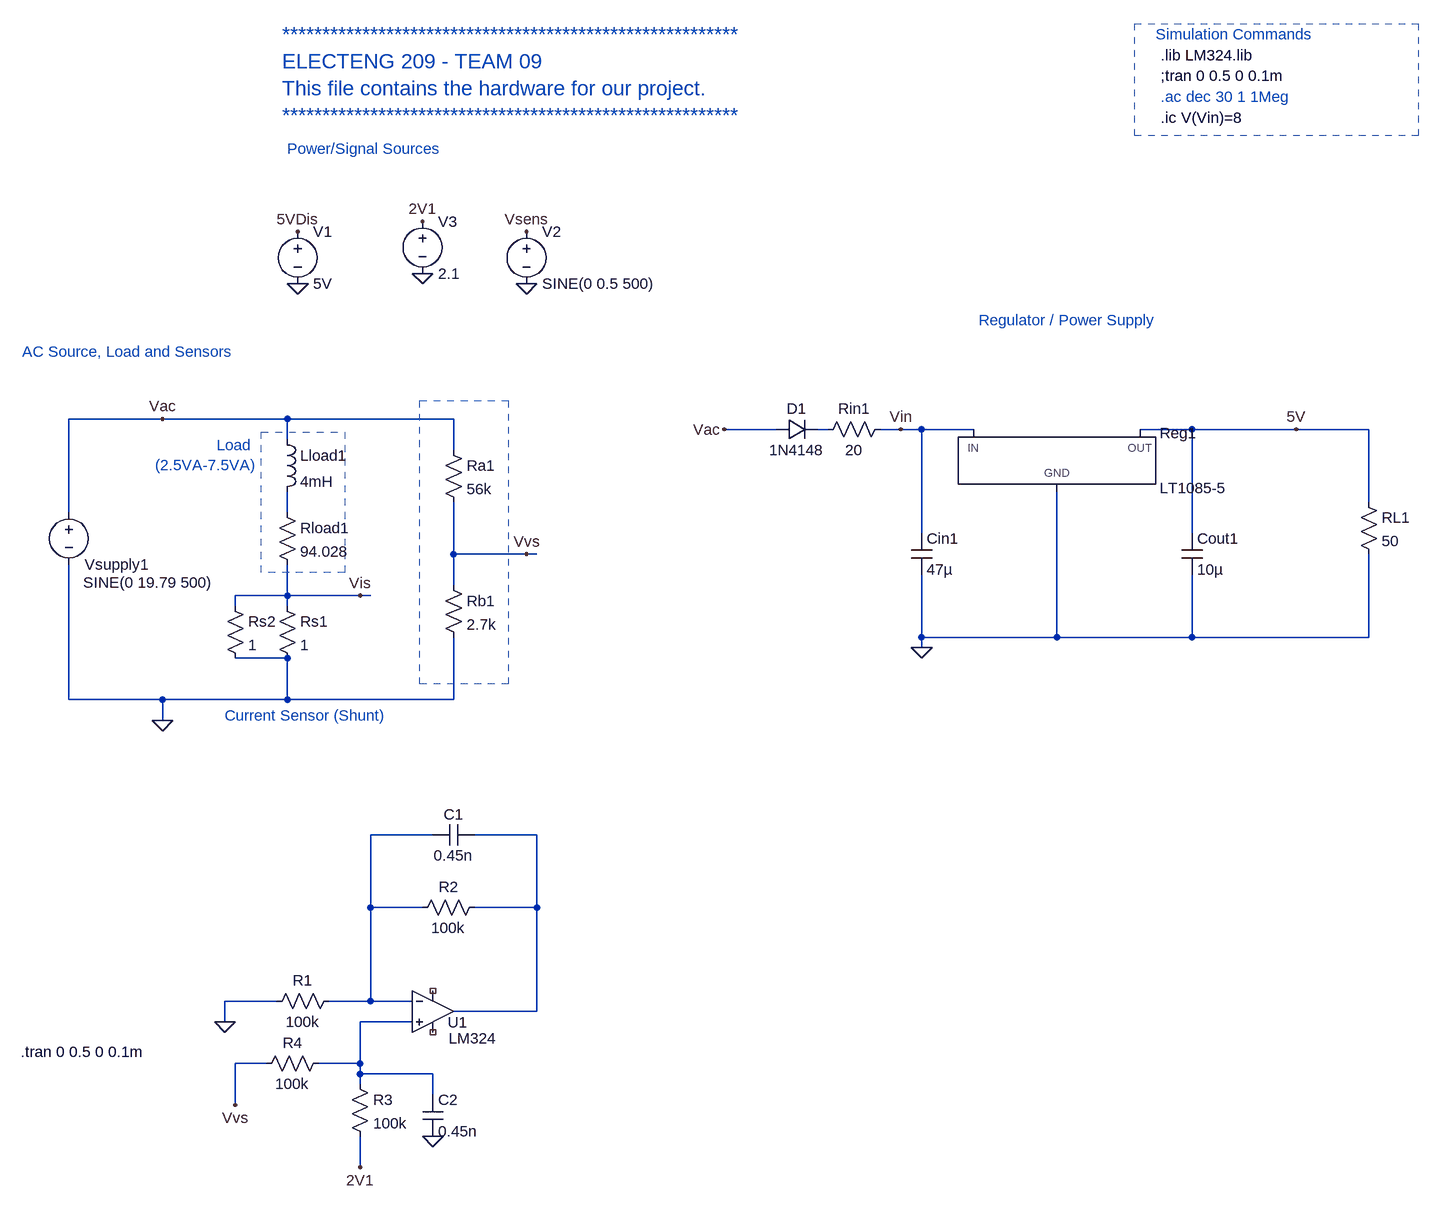
[diagram p0: schematic Final_Team_09_Hardware.asc]
Final_Team_09_Hardware.asc, the LTspice schematic file:
Version 4
SHEET 1 912 1884
WIRE -1024 640 -1168 640
WIRE -832 640 -1024 640
WIRE -576 640 -832 640
WIRE -80 656 -160 656
WIRE 0 656 -16 656
WIRE 112 656 80 656
WIRE 144 656 112 656
WIRE 224 656 144 656
WIRE 560 656 480 656
WIRE 720 656 560 656
WIRE 832 656 720 656
WIRE -832 672 -832 640
WIRE -576 688 -576 640
WIRE 832 768 832 656
WIRE -1168 784 -1168 640
WIRE -832 784 -832 752
WIRE 144 816 144 656
WIRE 560 816 560 656
WIRE -576 848 -576 768
WIRE -464 848 -576 848
WIRE -448 848 -464 848
WIRE -576 896 -576 848
WIRE -832 912 -832 864
WIRE -832 912 -912 912
WIRE -720 912 -832 912
WIRE -704 912 -720 912
WIRE -912 928 -912 912
WIRE -832 928 -832 912
WIRE 144 976 144 880
WIRE 352 976 352 752
WIRE 352 976 144 976
WIRE 560 976 560 880
WIRE 560 976 352 976
WIRE 832 976 832 848
WIRE 832 976 560 976
WIRE 144 992 144 976
WIRE -832 1008 -912 1008
WIRE -1168 1072 -1168 864
WIRE -1024 1072 -1168 1072
WIRE -832 1072 -832 1008
WIRE -832 1072 -1024 1072
WIRE -576 1072 -576 976
WIRE -576 1072 -832 1072
WIRE -1024 1104 -1024 1072
WIRE -608 1280 -704 1280
WIRE -448 1280 -544 1280
WIRE -704 1392 -704 1280
WIRE -624 1392 -704 1392
WIRE -448 1392 -448 1280
WIRE -448 1392 -544 1392
WIRE -848 1536 -928 1536
WIRE -704 1536 -704 1392
WIRE -704 1536 -768 1536
WIRE -640 1536 -704 1536
WIRE -448 1552 -448 1392
WIRE -448 1552 -576 1552
WIRE -928 1568 -928 1536
WIRE -640 1568 -720 1568
WIRE -864 1632 -912 1632
WIRE -720 1632 -720 1568
WIRE -720 1632 -784 1632
WIRE -720 1648 -720 1632
WIRE -608 1648 -720 1648
WIRE -720 1664 -720 1648
WIRE -608 1680 -608 1648
WIRE -912 1696 -912 1632
WIRE -720 1792 -720 1744
FLAG -816 432 0
FLAG -816 352 5VDis
FLAG -464 432 0
FLAG -464 352 Vsens
FLAG -1024 640 Vac
FLAG -720 912 Vis
FLAG -464 848 Vvs
FLAG -1024 1104 0
FLAG -160 656 Vac
FLAG 720 656 5V
FLAG 112 656 Vin
FLAG 144 992 0
FLAG -928 1568 0
FLAG -608 1744 0
FLAG -912 1696 Vvs
FLAG -720 1792 2V1
FLAG -624 416 0
FLAG -624 336 2V1
SYMBOL voltage -816 336 R0
WINDOW 123 0 0 Left 0
WINDOW 39 0 0 Left 0
SYMATTR InstName V1
SYMATTR Value 5V
SYMBOL voltage -464 336 R0
WINDOW 39 0 0 Left 0
SYMATTR InstName V2
SYMATTR Value SINE(0 0.5 500)
SYMATTR Value2 AC .1 0
SYMBOL voltage -1168 768 R0
WINDOW 0 24 96 Left 2
WINDOW 3 22 124 Left 2
WINDOW 123 0 0 Left 0
WINDOW 39 0 0 Left 0
SYMATTR InstName Vsupply1
SYMATTR Value SINE(0 19.79 500)
SYMBOL ind -848 656 R0
SYMATTR InstName Lload1
SYMATTR Value 4mH
SYMBOL res -592 672 R0
SYMATTR InstName Ra1
SYMATTR Value 56k
SYMBOL res -592 880 R0
SYMATTR InstName Rb1
SYMATTR Value 2.7k
SYMBOL res -848 768 R0
SYMATTR InstName Rload1
SYMATTR Value 94.028
SYMBOL PowerProducts/LT1085-5 352 656 R0
SYMATTR InstName Reg1
SYMBOL res 816 752 R0
SYMATTR InstName RL1
SYMATTR Value 50
SYMBOL res 96 640 R90
WINDOW 0 0 56 VBottom 2
WINDOW 3 32 56 VTop 2
SYMATTR InstName Rin1
SYMATTR Value 20
SYMBOL diode -80 672 R270
WINDOW 0 32 32 VTop 2
WINDOW 3 0 32 VBottom 2
SYMATTR InstName D1
SYMATTR Value 1N4148
SYMBOL cap 128 816 R0
SYMATTR InstName Cin1
SYMATTR Value 47µ
SYMATTR SpiceLine Rser=0.001
SYMBOL cap 544 816 R0
SYMATTR InstName Cout1
SYMATTR Value 10µ
SYMATTR SpiceLine Rser=0.001
SYMBOL res -848 912 R0
SYMATTR InstName Rs1
SYMATTR Value 1
SYMBOL res -928 912 R0
SYMATTR InstName Rs2
SYMATTR Value 1
SYMBOL Opamps/opamp2 -608 1488 R0
WINDOW 0 23 81 Left 2
WINDOW 3 24 105 Left 2
SYMATTR InstName U1
SYMATTR Value LM324
SYMBOL res -752 1520 R90
WINDOW 0 0 56 VBottom 2
WINDOW 3 32 56 VTop 2
SYMATTR InstName R1
SYMATTR Value 100k
SYMBOL res -528 1376 R90
WINDOW 0 0 56 VBottom 2
WINDOW 3 32 56 VTop 2
SYMATTR InstName R2
SYMATTR Value 100k
SYMBOL cap -544 1264 R90
WINDOW 0 0 32 VBottom 2
WINDOW 3 32 32 VTop 2
SYMATTR InstName C1
SYMATTR Value 0.45n
SYMBOL res -736 1648 R0
SYMATTR InstName R3
SYMATTR Value 100k
SYMBOL res -768 1616 R90
WINDOW 0 0 56 VBottom 2
WINDOW 3 32 56 VTop 2
SYMATTR InstName R4
SYMATTR Value 100k
SYMBOL cap -624 1680 R0
SYMATTR InstName C2
SYMATTR Value 0.45n
SYMBOL voltage -624 320 R0
WINDOW 123 0 0 Left 0
WINDOW 39 0 0 Left 0
SYMATTR InstName V3
SYMATTR Value 2.1
TEXT -840 48 Left 3 ;*********************************************************\nELECTENG 209 - TEAM 09\nThis file contains the hardware for our project.\n*********************************************************
TEXT 512 144 Left 2 ;.ac dec 30 1 1Meg
TEXT 512 80 Left 2 !.lib LM324.lib
TEXT 504 48 Left 2 ;Simulation Commands
TEXT 512 112 Left 2 !;tran 0 0.5 0 0.1m
TEXT 512 176 Left 2 !.ic V(Vin)=8
TEXT -832 224 Left 2 ;Power/Signal Sources
TEXT -1240 536 Left 2 ;AC Source, Load and Sensors
TEXT -880 680 Right 2 ;Load \n(2.5VA-7.5VA)
TEXT -928 1096 Left 2 ;Current Sensor (Shunt)
TEXT 232 488 Left 2 ;Regulator / Power Supply
TEXT -1242 1614 Left 2 !.tran 0 0.5 0 0.1m
RECTANGLE Normal 472 32 908 204 2
RECTANGLE Normal -872 660 -744 876 2
RECTANGLE Normal -628 612 -492 1048 2

The netlist it stands for:
* Final_Team_09_Hardware.asc
V1 5VDis 0 5V
V2 Vsens 0 SINE(0 0.5 500) AC .1 0
Vsupply1 Vac 0 SINE(0 19.79 500)
Lload1 Vac N002 4mH
Ra1 Vac Vvs 56k
Rb1 Vvs 0 2.7k
Rload1 N002 Vis 94.028
XReg1 0 5V Vin LT1085-5  ; pins GND OUT IN
RL1 5V 0 50
Rin1 Vin N001 20
D1 Vac N001 1N4148
Cin1 Vin 0 47µ Rser=0.001
Cout1 5V 0 10µ Rser=0.001
Rs1 Vis 0 1
Rs2 Vis 0 1
XU1 N005 N003 NC_01 NC_02 N004 LM324  ; pins In+ In- V+ V- OUT
R1 N003 0 100k
R2 N004 N003 100k
C1 N004 N003 0.45n
R3 N005 2V1 100k
R4 N005 Vvs 100k
C2 N005 0 0.45n
V3 2V1 0 2.1
.model D D
.lib standard.dio
* *********************************************************
* ELECTENG 209 - TEAM 09
* This file contains the hardware for our project.
* *********************************************************
* .ac dec 30 1 1Meg
.lib LM324.lib
* Simulation Commands
;tran 0 0.5 0 0.1m
.ic V(Vin)=8
* Power/Signal Sources
* AC Source, Load and Sensors
* Load
* (2.5VA-7.5VA)
* Current Sensor (Shunt)
* Regulator / Power Supply
.tran 0 0.5 0 0.1m
.backanno
.end